# Altium schematic sheet DAC.SchDoc
size 635 x 241 mm; SheetNumber: 2; SheetTotal: 4
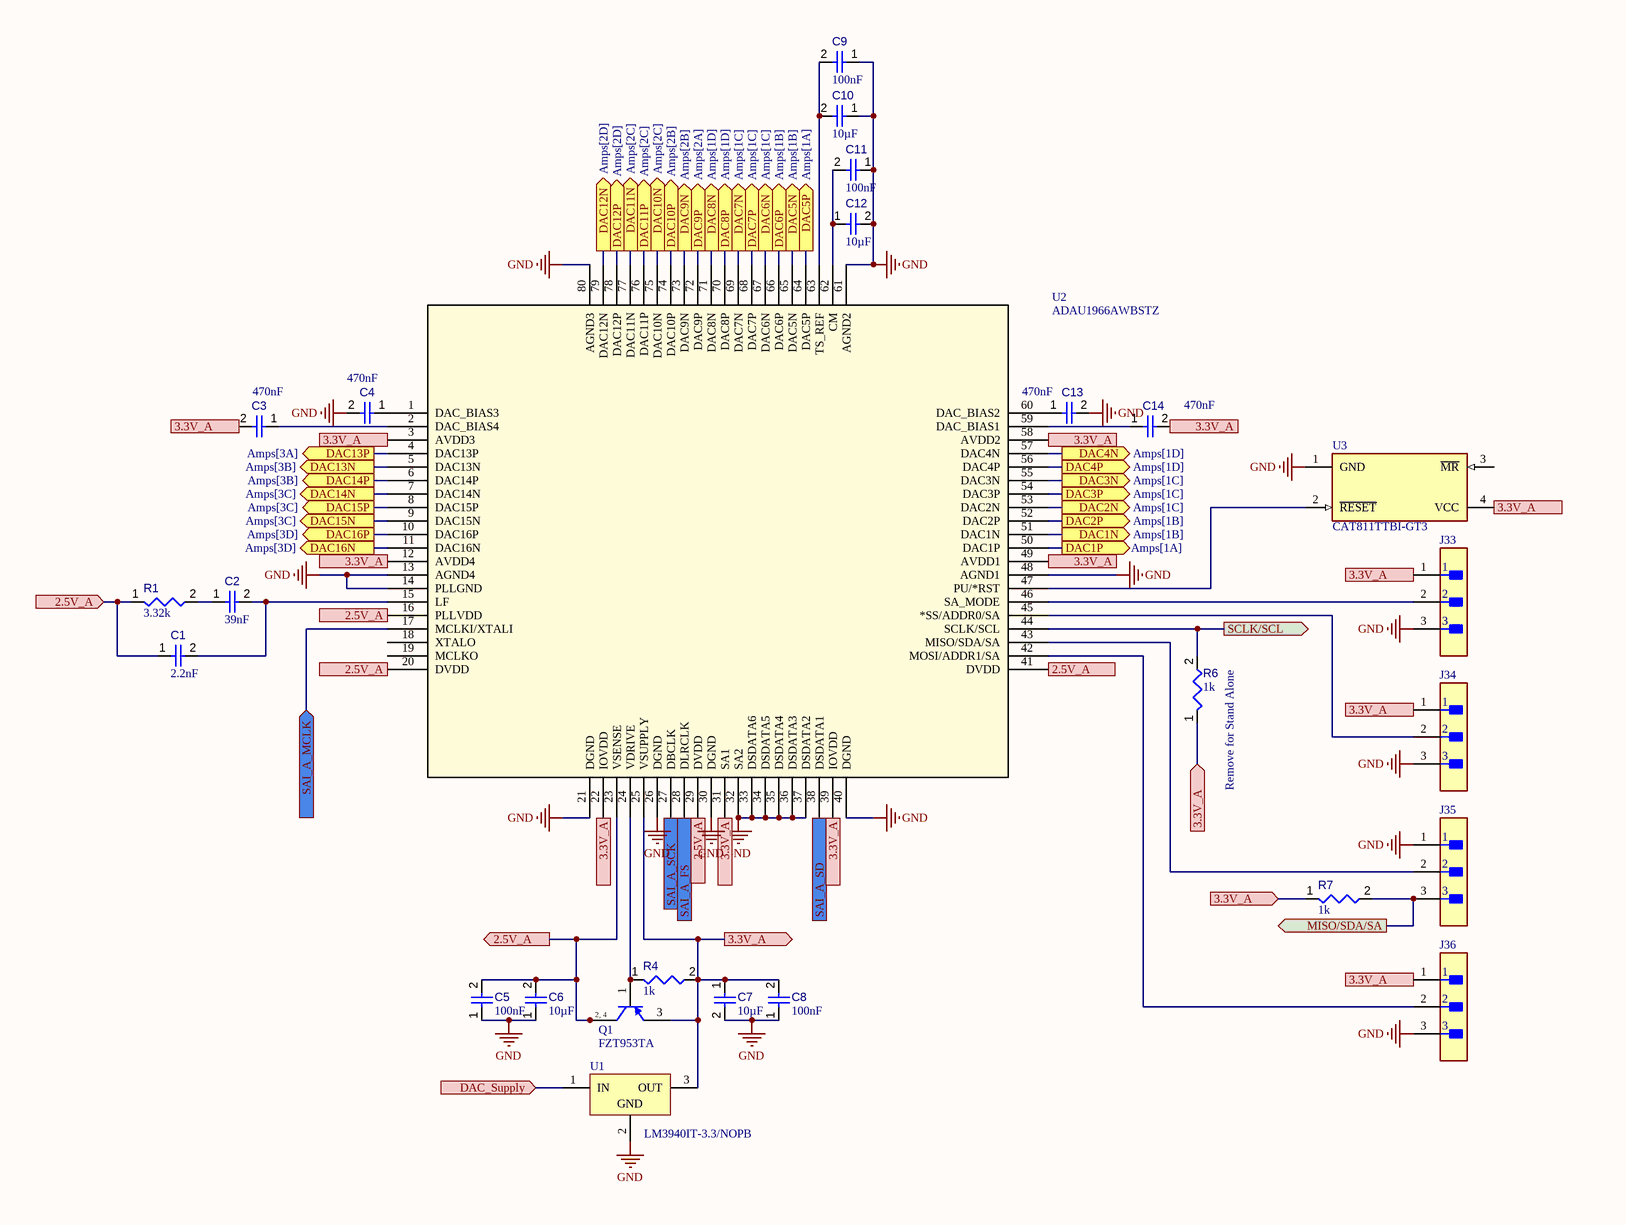
[diagram p0: DAC.SchDoc, left]
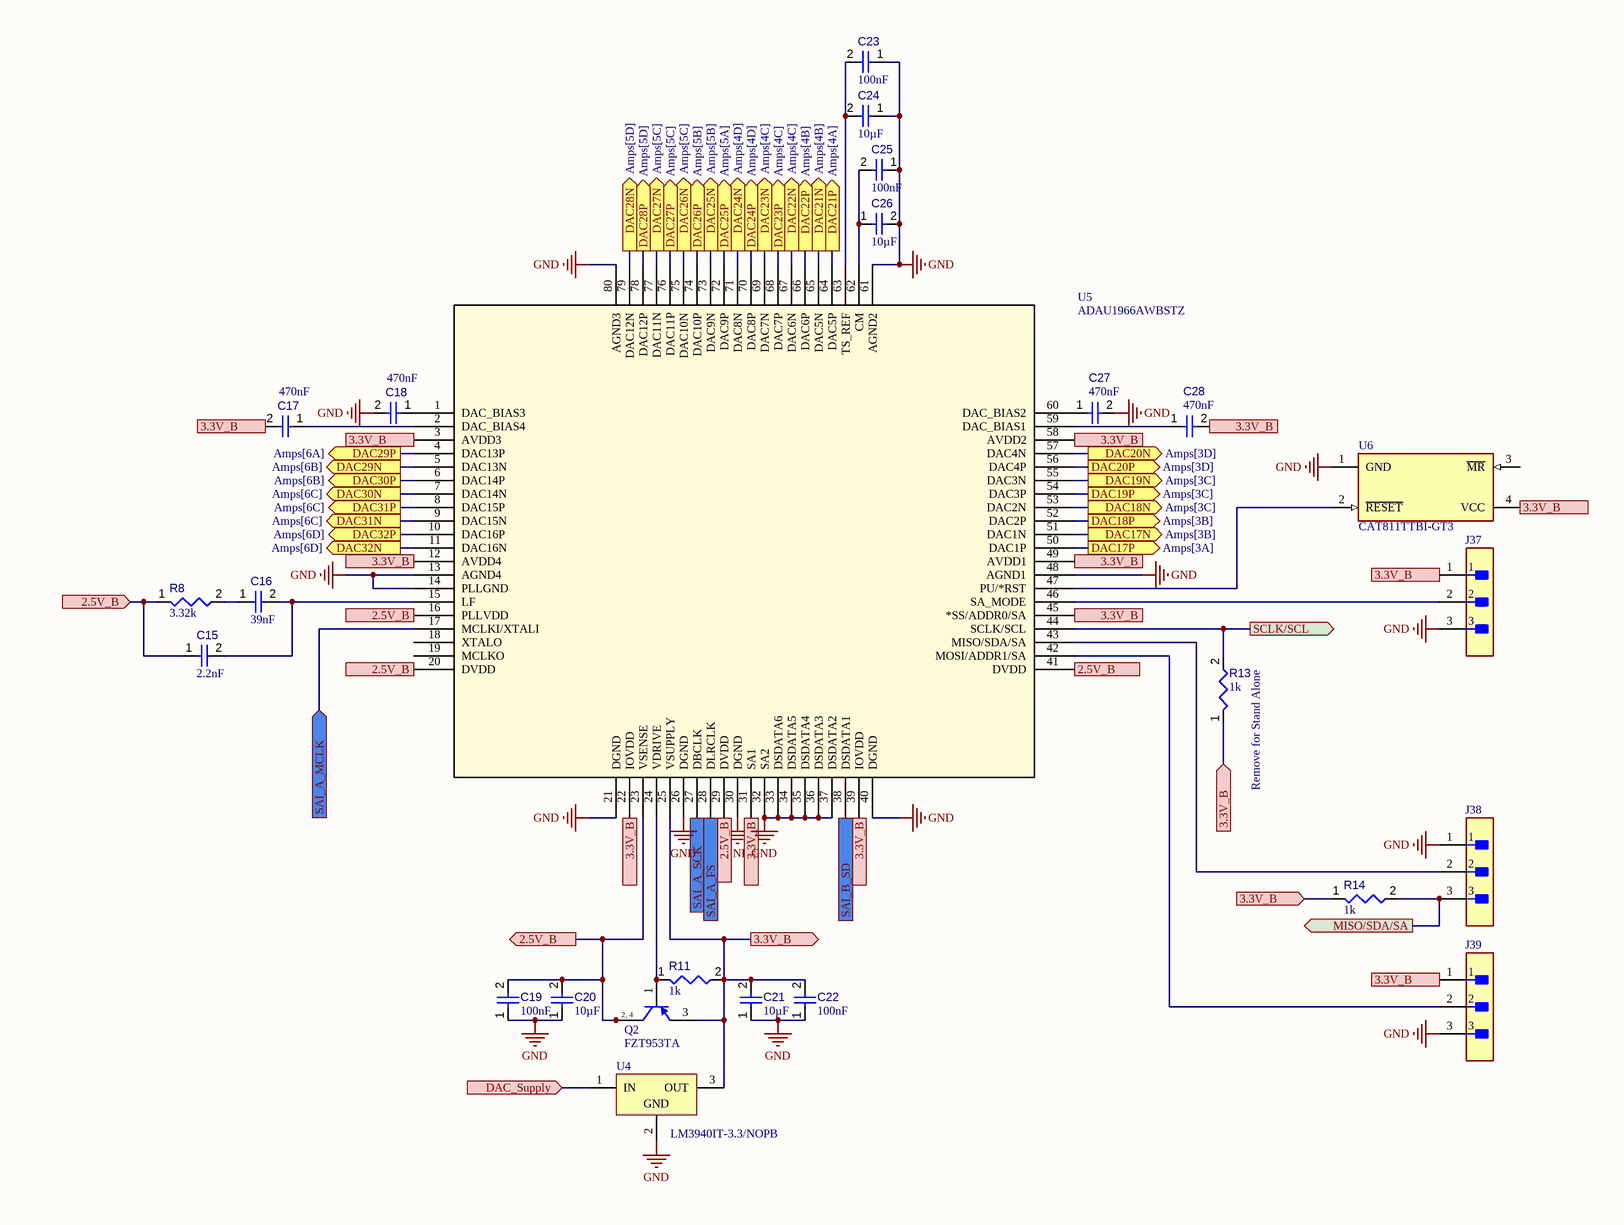
[diagram p1: DAC.SchDoc, right]

## Parts
C1  value 2.2nF  [CAPC0603(1608)100_L]  (hidden comment: Capacitor 2.2nF 0603,, 6V)
C2  value 39nF  [CAPC0805(2012)145_L]  (hidden comment: Capacitor 39nF 0805, 6V)
C3  value 470nF  [CAPC0603(1608)100_L]  (hidden comment: , 6V)
C4  value 470nF  [CAPC0603(1608)100_L]  (hidden comment: Capacitor 470nF 0603, 6V)
C5  value 100nF  [CAPC0603(1608)100_L]  (hidden comment: Capacitor 100nF 0603, 6V)
C6  value 10µF  [CAPC0805(2012)145_L]  (hidden comment: Capacitor 10µF 0805, 6V)
C7  value 10µF  [CAPC0805(2012)145_L]  (hidden comment: Capacitor 10µF 0805, 6V)
C8  value 100nF  [CAPC0603(1608)100_L]  (hidden comment: Capacitor 100nF 0603, 6V)
C9  value 100nF  [CAPC0603(1608)100_L]  (hidden comment: Capacitor 100nF 0603, 6V)
C10  value 10µF  [CAPC0805(2012)145_L]  (hidden comment: Capacitor 10µF 0805, 6V)
C11  value 100nF  [CAPC0603(1608)100_L]  (hidden comment: Capacitor 100nF 0603, 6V)
C12  value 10µF  [CAPC0805(2012)145_L]  (hidden comment: Capacitor 10µF 0805, 6V)
C13  value 470nF  [CAPC0603(1608)100_L]  (hidden comment: Capacitor 470nF 0603, 6V)
C14  value 470nF  [CAPC0603(1608)100_L]  (hidden comment: Capacitor 470nF 0603, 6V)
C15  value 2.2nF  [CAPC0603(1608)100_L]  (hidden comment: Capacitor 2.2nF 0603, 6V)
C16  value 39nF  [CAPC0805(2012)145_L]  (hidden comment: Capacitor 39nF 0805, 6V)
C17  value 470nF  [CAPC0603(1608)100_L]  (hidden comment: Capacitor 470nF +/-20% 25V 0603, 6V)
C18  value 470nF  [CAPC0603(1608)100_L]  (hidden comment: Capacitor 470nF +/-20% 25V 0603, 6V)
C19  value 100nF  [CAPC0603(1608)100_L]  (hidden comment: Capacitor 100nF 0603, 6V)
C20  value 10µF  [CAPC0805(2012)145_L]  (hidden comment: Capacitor 10µF 0805, 6V)
C21  value 10µF  [CAPC0805(2012)145_L]  (hidden comment: Capacitor 10µF 0805, 6V)
C22  value 100nF  [CAPC0603(1608)100_L]  (hidden comment: Capacitor 100nF 0603, 6V)
C23  value 100nF  [CAPC0603(1608)100_L]  (hidden comment: Capacitor 100nF 0603, 6V)
C24  value 10µF  [CAPC0805(2012)145_L]  (hidden comment: Capacitor 10µF 0805, 6V)
C25  value 100nF  [CAPC0603(1608)100_L]  (hidden comment: Capacitor 100nF 0603)
C26  value 10µF  [CAPC0805(2012)145_L]  (hidden comment: Capacitor 10µF 0805, 6V)
C27  value 470nF  [CAPC0603(1608)100_L]  (hidden comment: Capacitor 470nF 0603, 6V)
C28  value 470nF  [CAPC0603(1608)100_L]  (hidden comment: Capacitor 470nF 0603, 6V)
J33  87224-3  [FP-87224-3-MFG]  (value not drawn)
J34  87224-3  [FP-87224-3-MFG]  (value not drawn)
J35  87224-3  [FP-87224-3-MFG]  (value not drawn)
J36  87224-3  [FP-87224-3-MFG]  (value not drawn)
J37  87224-3  [FP-87224-3-MFG]  (value not drawn)
J38  87224-3  [FP-87224-3-MFG]  (value not drawn)
J39  87224-3  [FP-87224-3-MFG]  (value not drawn)
Q1  FZT953TA  [DIOD-SOT223-4_V]
Q2  FZT953TA  [DIOD-SOT223-4_V]
R1  value 3.32k  [RESC0603(1608)_L]  (hidden comment: Resistor 3.32k 0603 , 6V)
R4  value 1k  [RESC0603(1608)_L]  (hidden comment: Resistor 1k 0603, 6V)
R6  value 1k  [RESC0603(1608)_L]  (hidden comment: Resistor 1k 0603, 6V)
R7  value 1k  [RESC0603(1608)_L]  (hidden comment: Ressitor 1k 0603, 6V)
R8  value 3.32k  [RESC0603(1608)_L]  (hidden comment: Resistor 3.32k 0603, 6V)
R11  value 1k  [RESC0603(1608)_L]  (hidden comment: , 6V)
R13  value 1k  [RESC0603(1608)_L]  (hidden comment: Resistor 1k 0603, 6V)
R14  value 1k  [RESC0603(1608)_L]  (hidden comment: Resistor 1k 0603, 6V)
U1  LM3940IT-3.3/NOPB  [NDE0003A]
U2  ADAU1966AWBSTZ  [ST_80_2_ADI]
U3  CAT811TTBI-GT3  [FP-527AF-01-IPC_C]
U4  LM3940IT-3.3/NOPB  [NDE0003A]
U5  ADAU1966AWBSTZ  [ST_80_2_ADI]
U6  CAT811TTBI-GT3  [FP-527AF-01-IPC_C]

## Ports
2.5V_A (in, see DAC[1B], DAC[1C], DAC[1D], DAC[2C]), 2.5V_A (in, see DAC[1C], DAC[1D], DAC[2C]), 2.5V_A (out, see DAC[1B], DAC[1C], DAC[2C]), 2.5V_B (in, see DAC[4B], DAC[4C], DAC[4D], DAC[5C]), 2.5V_B (in, see DAC[4C], DAC[4D], DAC[5C]), 2.5V_B (out, see DAC[4B], DAC[4C], DAC[5C]), 3.3V_A (in, see DAC[1B], DAC[2B], DAC[2C], DAC[2D], DAC[3B], DAC[3C], DAC[3D], IO[6A]), 3.3V_A (in, see DAC[1B], DAC[2B], DAC[2C], DAC[2D], DAC[3B], DAC[3C], IO[6A]), 3.3V_A (out, see DAC[1B], DAC[2B], DAC[2C], DAC[3B], DAC[3C], DAC[3D], IO[6A]), 3.3V_B (in, see DAC[4B], DAC[5B], DAC[5C], DAC[5D], DAC[6B], DAC[6C], DAC[6D], IO[6C]), 3.3V_B (in, see DAC[4B], DAC[5B], DAC[5C], DAC[5D], DAC[6B], DAC[6C], IO[6C]), 3.3V_B (out, see DAC[4B], DAC[5B], DAC[5C], DAC[6B], DAC[6C], DAC[6D], IO[6C]), DAC1N (out, see Amps[1B]), DAC1P (out, see Amps[1A]), DAC2N (out, see Amps[1C]), DAC2P (out, see Amps[1B]), DAC3N (out, see Amps[1C]), DAC3P (out, see Amps[1C]), DAC4N (out, see Amps[1D]), DAC4P (out, see Amps[1D]), DAC5N (out, see Amps[1B]), DAC5P (out, see Amps[1A]), DAC6N (out, see Amps[1C]), DAC6P (out, see Amps[1B]), DAC7N (out, see Amps[1C]), DAC7P (out, see Amps[1C]), DAC8N (out, see Amps[1D]), DAC8P (out, see Amps[1D]), DAC9N (out, see Amps[2B]), DAC9P (out, see Amps[2A]), DAC10N (out, see Amps[2C]), DAC10P (out, see Amps[2B]), DAC11N (out, see Amps[2C]), DAC11P (out, see Amps[2C]), DAC12N (out, see Amps[2D]), DAC12P (out, see Amps[2D]), DAC13N (out, see Amps[3B]), DAC13P (out, see Amps[3A]), DAC14N (out, see Amps[3C]), DAC14P (out, see Amps[3B]), DAC15N (out, see Amps[3C]), DAC15P (out, see Amps[3C]), DAC16N (out, see Amps[3D]), DAC16P (out, see Amps[3D]), DAC17N (out, see Amps[3B]), DAC17P (out, see Amps[3A]), DAC18N (out, see Amps[3C]), DAC18P (out, see Amps[3B]), DAC19N (out, see Amps[3C]), DAC19P (out, see Amps[3C]), DAC20N (out, see Amps[3D]), DAC20P (out, see Amps[3D]), DAC21N (out, see Amps[4B]), DAC21P (out, see Amps[4A]), DAC22N (out, see Amps[4C]), DAC22P (out, see Amps[4B]), DAC23N (out, see Amps[4C]), DAC23P (out, see Amps[4C]), DAC24N (out, see Amps[4D]), DAC24P (out, see Amps[4D]), DAC25N (out, see Amps[5B]), DAC25P (out, see Amps[5A]), DAC26N (out, see Amps[5C]), DAC26P (out, see Amps[5B]), DAC27N (out, see Amps[5C]), DAC27P (out, see Amps[5C]), DAC28N (out, see Amps[5D]), DAC28P (out, see Amps[5D]), DAC29N (out, see Amps[6B]), DAC29P (out, see Amps[6A]), DAC30N (out, see Amps[6C]), DAC30P (out, see Amps[6B]), DAC31N (out, see Amps[6C]), DAC31P (out, see Amps[6C]), DAC32N (out, see Amps[6D]), DAC32P (out, see Amps[6D]), DAC_Supply (in, see DAC[1D], NUCLEO[2C]), DAC_Supply (in, see DAC[4D], NUCLEO[2C]), MISO/SDA/SA (out, see DAC[3C], NUCLEO[4C]), MISO/SDA/SA (out, see DAC[6C], NUCLEO[4C]), SAI_A_FS (in, see DAC[2C], NUCLEO[2C]), SAI_A_FS (in, see DAC[5C], NUCLEO[2C]), SAI_A_MCLK (in, see DAC[1C], NUCLEO[2C]), SAI_A_MCLK (in, see DAC[4C], NUCLEO[2C]), SAI_A_SCK (in, see DAC[2C], NUCLEO[2C]), SAI_A_SCK (in, see DAC[5C], NUCLEO[2C]), SAI_A_SD (in, see NUCLEO[2C]), SAI_B_SD (in, see NUCLEO[4C]), SCLK/SCL (out, see DAC[3C], NUCLEO[4C]), SCLK/SCL (out, see DAC[6C], NUCLEO[4C])

## Nets
GND: C4.2 C5.1 C6.1 C7.2 C8.1 C9.1 C10.1 C11.1 C12.2 C13.2 C18.2 C19.1 C20.1 C21.1 C22.1 C23.1 C24.1 C25.1 C26.2 C27.2 J33.3 J34.3 J35.1 J36.3 J37.3 J38.1 J39.3 U1.2(GND) U2.13(AGND4) U2.14(PLLGND) U2.21(DGND) U2.26(DGND) U2.30(DGND) U2.32(SA2) U2.33(DSDATA6) U2.34(DSDATA5) U2.35(DSDATA4) U2.36(DSDATA3) U2.37(DSDATA2) U2.40(DGND) U2.48(AGND1) U2.61(AGND2) U2.80(AGND3) U3.1(GND) U4.2(GND) U5.13(AGND4) U5.14(PLLGND) U5.21(DGND) U5.26(DGND) U5.30(DGND) U5.32(SA2) U5.33(DSDATA6) U5.34(DSDATA5) U5.35(DSDATA4) U5.36(DSDATA3) U5.37(DSDATA2) U5.40(DGND) U5.48(AGND1) U5.61(AGND2) U5.80(AGND3) U6.1(GND)
2.5V_A: C1.1 C5.2 C6.2 Q1.2(C) Q1.4(C) R1.1 U2.16(PLLVDD) U2.20(DVDD) U2.23(VSENSE) U2.29(DVDD) U2.41(DVDD) ; port 2.5V_A
2.5V_B: C15.1 C19.2 C20.2 Q2.2(C) Q2.4(C) R8.1 U5.16(PLLVDD) U5.20(DVDD) U5.23(VSENSE) U5.29(DVDD) U5.41(DVDD) ; port 2.5V_B
3.3V_A: C3.2 C7.1 C8.2 C14.2 J33.1 J34.1 J36.1 Q1.3(E) R4.2 R6.1 R7.1 U1.3(OUT) U2.3(AVDD3) U2.12(AVDD4) U2.22(IOVDD) U2.25(VSUPPLY) U2.31(SA1) U2.39(IOVDD) U2.49(AVDD1) U2.58(AVDD2) U3.4(VCC) ; port 3.3V_A
3.3V_B: C17.2 C21.2 C22.2 C28.2 J37.1 J39.1 Q2.3(E) R11.2 R13.1 R14.1 U4.3(OUT) U5.3(AVDD3) U5.12(AVDD4) U5.22(IOVDD) U5.25(VSUPPLY) U5.31(SA1) U5.39(IOVDD) U5.45(*SS/ADDR0/SA) U5.49(AVDD1) U5.58(AVDD2) U6.4(VCC) ; port 3.3V_B
DAC1N: U2.51(DAC1N) ; port DAC1N
DAC1P: U2.50(DAC1P) ; port DAC1P
DAC2N: U2.53(DAC2N) ; port DAC2N
DAC2P: U2.52(DAC2P) ; port DAC2P
DAC3N: U2.55(DAC3N) ; port DAC3N
DAC3P: U2.54(DAC3P) ; port DAC3P
DAC4N: U2.57(DAC4N) ; port DAC4N
DAC4P: U2.56(DAC4P) ; port DAC4P
DAC5N: U2.65(DAC5N) ; port DAC5N
DAC5P: U2.64(DAC5P) ; port DAC5P
DAC6N: U2.67(DAC6N) ; port DAC6N
DAC6P: U2.66(DAC6P) ; port DAC6P
DAC7N: U2.69(DAC7N) ; port DAC7N
DAC7P: U2.68(DAC7P) ; port DAC7P
DAC8N: U2.71(DAC8N) ; port DAC8N
DAC8P: U2.70(DAC8P) ; port DAC8P
DAC9N: U2.73(DAC9N) ; port DAC9N
DAC9P: U2.72(DAC9P) ; port DAC9P
DAC10N: U2.75(DAC10N) ; port DAC10N
DAC10P: U2.74(DAC10P) ; port DAC10P
DAC11N: U2.77(DAC11N) ; port DAC11N
DAC11P: U2.76(DAC11P) ; port DAC11P
DAC12N: U2.79(DAC12N) ; port DAC12N
DAC12P: U2.78(DAC12P) ; port DAC12P
DAC13N: U2.5(DAC13N) ; port DAC13N
DAC13P: U2.4(DAC13P) ; port DAC13P
DAC14N: U2.7(DAC14N) ; port DAC14N
DAC14P: U2.6(DAC14P) ; port DAC14P
DAC15N: U2.9(DAC15N) ; port DAC15N
DAC15P: U2.8(DAC15P) ; port DAC15P
DAC16N: U2.11(DAC16N) ; port DAC16N
DAC16P: U2.10(DAC16P) ; port DAC16P
DAC17N: U5.51(DAC1N) ; port DAC17N
DAC17P: U5.50(DAC1P) ; port DAC17P
DAC18N: U5.53(DAC2N) ; port DAC18N
DAC18P: U5.52(DAC2P) ; port DAC18P
DAC19N: U5.55(DAC3N) ; port DAC19N
DAC19P: U5.54(DAC3P) ; port DAC19P
DAC20N: U5.57(DAC4N) ; port DAC20N
DAC20P: U5.56(DAC4P) ; port DAC20P
DAC21N: U5.65(DAC5N) ; port DAC21N
DAC21P: U5.64(DAC5P) ; port DAC21P
DAC22N: U5.67(DAC6N) ; port DAC22N
DAC22P: U5.66(DAC6P) ; port DAC22P
DAC23N: U5.69(DAC7N) ; port DAC23N
DAC23P: U5.68(DAC7P) ; port DAC23P
DAC24N: U5.71(DAC8N) ; port DAC24N
DAC24P: U5.70(DAC8P) ; port DAC24P
DAC25N: U5.73(DAC9N) ; port DAC25N
DAC25P: U5.72(DAC9P) ; port DAC25P
DAC26N: U5.75(DAC10N) ; port DAC26N
DAC26P: U5.74(DAC10P) ; port DAC26P
DAC27N: U5.77(DAC11N) ; port DAC27N
DAC27P: U5.76(DAC11P) ; port DAC27P
DAC28N: U5.79(DAC12N) ; port DAC28N
DAC28P: U5.78(DAC12P) ; port DAC28P
DAC29N: U5.5(DAC13N) ; port DAC29N
DAC29P: U5.4(DAC13P) ; port DAC29P
DAC30N: U5.7(DAC14N) ; port DAC30N
DAC30P: U5.6(DAC14P) ; port DAC30P
DAC31N: U5.9(DAC15N) ; port DAC31N
DAC31P: U5.8(DAC15P) ; port DAC31P
DAC32N: U5.11(DAC16N) ; port DAC32N
DAC32P: U5.10(DAC16P) ; port DAC32P
DAC_Supply: U1.1(IN) U4.1(IN) ; port DAC_Supply
MISO/SDA/SA: J35.3 J38.3 R7.2 R14.2 ; port MISO/SDA/SA
SAI_A_FS: U2.28(DLRCLK) U5.28(DLRCLK) ; port SAI_A_FS
SAI_A_MCLK: U2.17(MCLKI/XTALI) U5.17(MCLKI/XTALI) ; port SAI_A_MCLK
SAI_A_SCK: U2.27(DBCLK) U5.27(DBCLK) ; port SAI_A_SCK
SAI_A_SD: U2.38(DSDATA1) ; port SAI_A_SD
SAI_B_SD: U5.38(DSDATA1) ; port SAI_B_SD
SCLK/SCL: R6.2 R13.2 U2.44(SCLK/SCL) U5.44(SCLK/SCL) ; port SCLK/SCL
NetC1_2: C1.2 C2.2 U2.15(LF)
NetC2_1: C2.1 R1.2
NetC3_1: C3.1 U2.2(DAC_BIAS4)
NetC4_1: C4.1 U2.1(DAC_BIAS3)
NetC9_2: C9.2 C10.2 U2.63(TS_REF)
NetC11_2: C11.2 C12.1 U2.62(CM)
NetC13_1: C13.1 U2.60(DAC_BIAS2)
NetC14_1: C14.1 U2.59(DAC_BIAS1)
NetC15_2: C15.2 C16.2 U5.15(LF)
NetC16_1: C16.1 R8.2
NetC17_1: C17.1 U5.2(DAC_BIAS4)
NetC18_1: C18.1 U5.1(DAC_BIAS3)
NetC23_2: C23.2 C24.2 U5.63(TS_REF)
NetC25_2: C25.2 C26.1 U5.62(CM)
NetC27_1: C27.1 U5.60(DAC_BIAS2)
NetC28_1: C28.1 U5.59(DAC_BIAS1)
NetJ33_2: J33.2 U2.46(SA_MODE)
NetJ34_2: J34.2 U2.45(*SS/ADDR0/SA)
NetJ35_2: J35.2 U2.43(MISO/SDA/SA)
NetJ36_2: J36.2 U2.42(MOSI/ADDR1/SA)
NetJ37_2: J37.2 U5.46(SA_MODE)
NetJ38_2: J38.2 U5.43(MISO/SDA/SA)
NetJ39_2: J39.2 U5.42(MOSI/ADDR1/SA)
NetQ1_1: Q1.1(B) R4.1 U2.24(VDRIVE)
NetQ2_1: Q2.1(B) R11.1 U5.24(VDRIVE)
NetU2_47: U2.47(PU/*RST) U3.2(~{RESET})
NetU5_47: U5.47(PU/*RST) U6.2(~{RESET})

Not connected (* = marked no-connect by the designer): U2 18(XTALO) 19(MCLKO); U3 3(~{MR}); U5 18(XTALO) 19(MCLKO); U6 3(~{MR})

## Notes on the sheet
- (near R6) Remove for Stand Alone
- (near R13) Remove for Stand Alone
- (in symbol CMP-2000-06302-1) 2, 4

## Library data of the parts
C1 = CMP-001-00077-3: Chip Capacitor, 2.2nF 0603,; Tolerance: 10%; Voltage Rating: 25V; Mounting Technology: SMT; Max Operating Temperature: 85°C; Min Operating Temperature: -55°C; Pins: 2; Case/Package: 0603
C2 = CMP-001-00080-4: Chip Capacitor, 39nF  0805,; Voltage Rating: 25V; Tolerance: 20%; Min Operating Temperature: -55°C; Max Operating Temperature: 85°C; Pins: 2; Mounting Technology: SMT; Case/Package: 0805
C3 C14 C28 = CMP-001-00077-3: Chip Capacitor, 470nF 0603,; Voltage Rating: 25V; Tolerance: 10%; Min Operating Temperature: -55°C; Max Operating Temperature: 85°C; Pins: 2; Mounting Technology: SMT; Case/Package: 0603
C4 = CMP-001-00077-3: Chip Capacitor, 470nF  0603; Voltage Rating: 25V; Tolerance: 10%; Min Operating Temperature: -55°C; Max Operating Temperature: 85°C; Pins: 2; Mounting Technology: SMT; Case/Package: 0603
C5 C8 C19 C22 = CMP-001-00077-3: Chip Capacitor, 100nF 0603,; Voltage Rating: 25V; Tolerance: 10%; Max Operating Temperature: 85°C; Min Operating Temperature: -55°C; Case/Package: 0603; Mounting Technology: SMT; Pins: 2
C6 C10 C12 C20 C21 C24 C26 = CMP-001-00079-4: Chip Capacitor, 10µF 0805,; Voltage Rating: 25V; Tolerance: 10%; Min Operating Temperature: -55°C; Case/Package: 0805; Max Operating Temperature: 85°C; Mounting Technology: SMT; Pins: 2
C7 = CMP-001-00079-4: Chip Capacitor, 10µF 0805; Voltage Rating: 25V; Tolerance: 10%; Min Operating Temperature: -55°C; Case/Package: 0805; Max Operating Temperature: 85°C; Mounting Technology: SMT; Pins: 2
C9 C11 C23 = CMP-001-00075-4: Capacitor 100nF 0603; Voltage Rating: 10V; Tolerance: 10%; Max Operating Temperature: 85°C; Min Operating Temperature: -55°C; Case/Package: 0603; Mounting Technology: SMT; Pins: 2
C13 C27 = CMP-001-00077-3: Chip Capacitor, 470nF  0603,; Voltage Rating: 25V; Tolerance: 10%; Min Operating Temperature: -55°C; Max Operating Temperature: 85°C; Pins: 2; Mounting Technology: SMT; Case/Package: 0603
C15 = CMP-001-00077-3: Chip Capacitor, 2.2nF  0603,; Tolerance: 10%; Voltage Rating: 25V; Mounting Technology: SMT; Max Operating Temperature: 85°C; Min Operating Temperature: -55°C; Pins: 2; Case/Package: 0603
C16 = CMP-001-00080-4: Chip Capacitor, 39nF 0805,; Voltage Rating: 25V; Tolerance: 20%; Min Operating Temperature: -55°C; Max Operating Temperature: 85°C; Pins: 2; Mounting Technology: SMT; Case/Package: 0805
C17 C18 = CMP-001-00077-3: Chip Capacitor, 470nF +/-20%, 25V, 0603, Thickness 1 mm; Tolerance: 10%; Voltage Rating: 25V; Min Operating Temperature: -55°C; Max Operating Temperature: 85°C; Pins: 2; Mounting Technology: SMT; Case/Package: 0603
C25 = CMP-001-00075-4: Voltage Rating: 10V; Tolerance: 10%; Max Operating Temperature: 85°C; Min Operating Temperature: -55°C; Case/Package: 0603; Mounting Technology: SMT; Pins: 2
J33-J39 = CMP-2000-05697-2: CONN HEADER VERT 3POS 2.54MM; Number of Positions: 3; Gasket: No (Without); High Speed Serial Data Connector: No; Current Rating: 3A; Contact Post Length: 0.125inch; PCB Thickness: 1.397mm; PCB Mount Retention: Without; Connector Type: Plug; Approvals: CSA; PCB Mounting Orientation: Vertical; Pitch: 2.54mm; Mating Alignment: No (Without); Housing Color: Black; Contact Gender: Male; Length: 7.21mm; Max Operating Temperature: 105°C; Strain Relief: No (Without); Contact Material: Bronze; Row Spacing: 2.54mm; Series: AMPMODU MOD II; Board Standoff: No (Without); Package Quantity: 520; Radiation Hardening: No; Contact Protection: No (Without); Stabilizers: No (Without); Number of Rows: 1; Contact Mating Length: 8.08mm; Contact Shape: Square; Depth: 2.54mm; Contact Current Rating: 3A; Flammability Rating: UL94 V-0; Packaging: Carton; Number of Contacts: 3; Orientation: Straight; Mount: Through Hole; Keyed: No; Contact Type: Male Pin; Housing Material: Thermoplastic; High Temperature Housing: No; ELV: Compliant; Contact Plating: Gold; Termination: Through Hole; Selectively Loaded: No (Without); Lead Free: Lead Free; Min Operating Temperature: -65°C; Mating Connector Lock: No (Without); Color: Black; RoHS Compliant: Yes
Q1 Q2 = CMP-2000-06302-1: PNP Silicon Planar High Current (high Performance) Transistor, 100 V, 3 W, -55 to 150 degC, 4-Pin SOT223, RoHS, Tape and Reel; Collector- Emitter Voltage VCEO Max: -100V; Configuration: Single; Package Version: 06/2015; DC Collector/Base Gain hfe Min: 15at-10A,-1V; DC Current Gain hFE Max: 100; Collector- Base Voltage VCBO: -140V; Gain Bandwidth Product fT: 125MHz; Maximum DC Collector Current: -10A; Collector-Emitter Saturation Voltage: -420mV; Unit Weight: 0.000282oz; Pd - Power Dissipation: 3W; Brand: DiodesIncorporated; Emitter- Base Voltage VEBO: -7V; Maximum Operating Temperature: +150C; Package Description: 4-Pin Small Outline Transistor, Body 6.5 x 3.5 mm, Pitch 2.3 mm; Package URL: http://www.diodes.com/_files/packages/SOT223.pdf; Datasheet Version: 04/2000; Manufacturer URL: http://www.diodes.com/; Packaging: Reel; Product Category: BipolarTransistors-BJT; Series: FZT953; Mounting Style: SMD/SMT; RoHS: True; Transistor Polarity: PNP; Package Reference: SOT223-4; Package / Case: SOT-223; Datasheet URL: http://www.diodes.com/_files/datasheets/FZT951_FZT953.pdf; Factory Pack Quantity: 1000; Height: 1.65mm(Max); Minimum Operating Temperature: -55C; Width: 3.7mm(Max); Mounting Technology: SurfaceMount; Manufacturer: DiodesIncorporated; Length: 6.7mm(Max)
R1 R8 = CMP-009-00175-3: Resistor 3.32k 0603; Pins: 2; Min Operating Temperature: -55°C; Max Operating Temperature: 155°C; Case/Package: 0603
R4 R6 R13 = CMP-009-00175-3: Resistor1k 0603; Pins: 2; Min Operating Temperature: -55°C; Max Operating Temperature: 155°C; Case/Package: 0603
R7 R11 R14 = CMP-009-00175-3: Resistor 1k 0603; Pins: 2; Min Operating Temperature: -55°C; Max Operating Temperature: 155°C; Case/Package: 0603
U1 U4 = CMP-0062-02467-3: 1A Low Dropout Regulator for 5V to 3.3V Conversion, 3-pin TO-220, Pb-Free; Manufacturer: Texas Instruments; PackageTopMarking: NSUZXYTTE#*LM3940IT*-3.3 P+; CompType: LDO IC; PowerWise: N; PinCount: 3; RoHS: Y; PackageDescription: TO-220, Molded, 3 Lead, Straight; PackageReference: NDE0003A; ComponentLink1URL: http://www.ti.com/general/docs/lit/getliterature.tsp?genericPartNumber=LM3940&fileType=pdf; ComponentLink1Description: Datasheet URL
U2 U5 = ADAU1966AWBSTZ: No Description Available; Mfr_Name: Analog Devices Inc; Copyright: Copyright (C) 2024 Ultra Librarian. All rights reserved.; Manufacturer_Part_Number: ADAU1966AWBSTZ; RefDes: RefDes; Type: DEV
U3 U6 = CMP-07130-000010-1: IC SUPERVISOR 1 CHANNEL SOT143; Manufacturer: ON Semiconductor; Reset Timeout: 240ms; Threshold Voltage: 3.08V; Number Of Outputs: 1; Standoff Height: 0.05mm; Min Supply Voltage: 1V; Max Supply Voltage: 5.5V; Reset Type: Active Low; Max Power Dissipation: 320mW; Output Current: 20mA; Nominal Supply Current: 6-8uA; Device Class L2: Power Management ICs; Mouser Description: Supervisory Circuits Act. Lo w/PB 4-pin; Temperature Range Low: -40°C; Ambient Temperature Range High: +85°C; Category: IC; Device Class L3: Voltage Supervisors; Temperature: -40°C to +85°C; Ambient Temperature Range Low: -40°C; RoHS: TRUE; Number Of Rails Monitored: 1; Height: 1.22mm; Automotive: No; ComponentLink2URL: https://www.onsemi.com/pub/Collateral/CAT811-D.PDF; Octopart: https://octopart.com/cat811ttbi-gt3-on+semiconductor-13128977; ComponentLink2Description: Datasheet; Manufacturer Part Number: CAT811TTBI-GT3; Package: 527AF-01; Lead Free: Yes; Device Class L1: Integrated Circuits (ICs); Temperature Range High: +85°C; Digikey Description: IC SUPERVISOR 1 CHANNEL SOT143; Footprint Url: https://www.onsemi.com/pub/Collateral/527AF.PDF